# EAGLE schematic PlatineUntenV2 (EAGLE 9.3.0)

## Sheet 1 of 7: Teensy 3.6
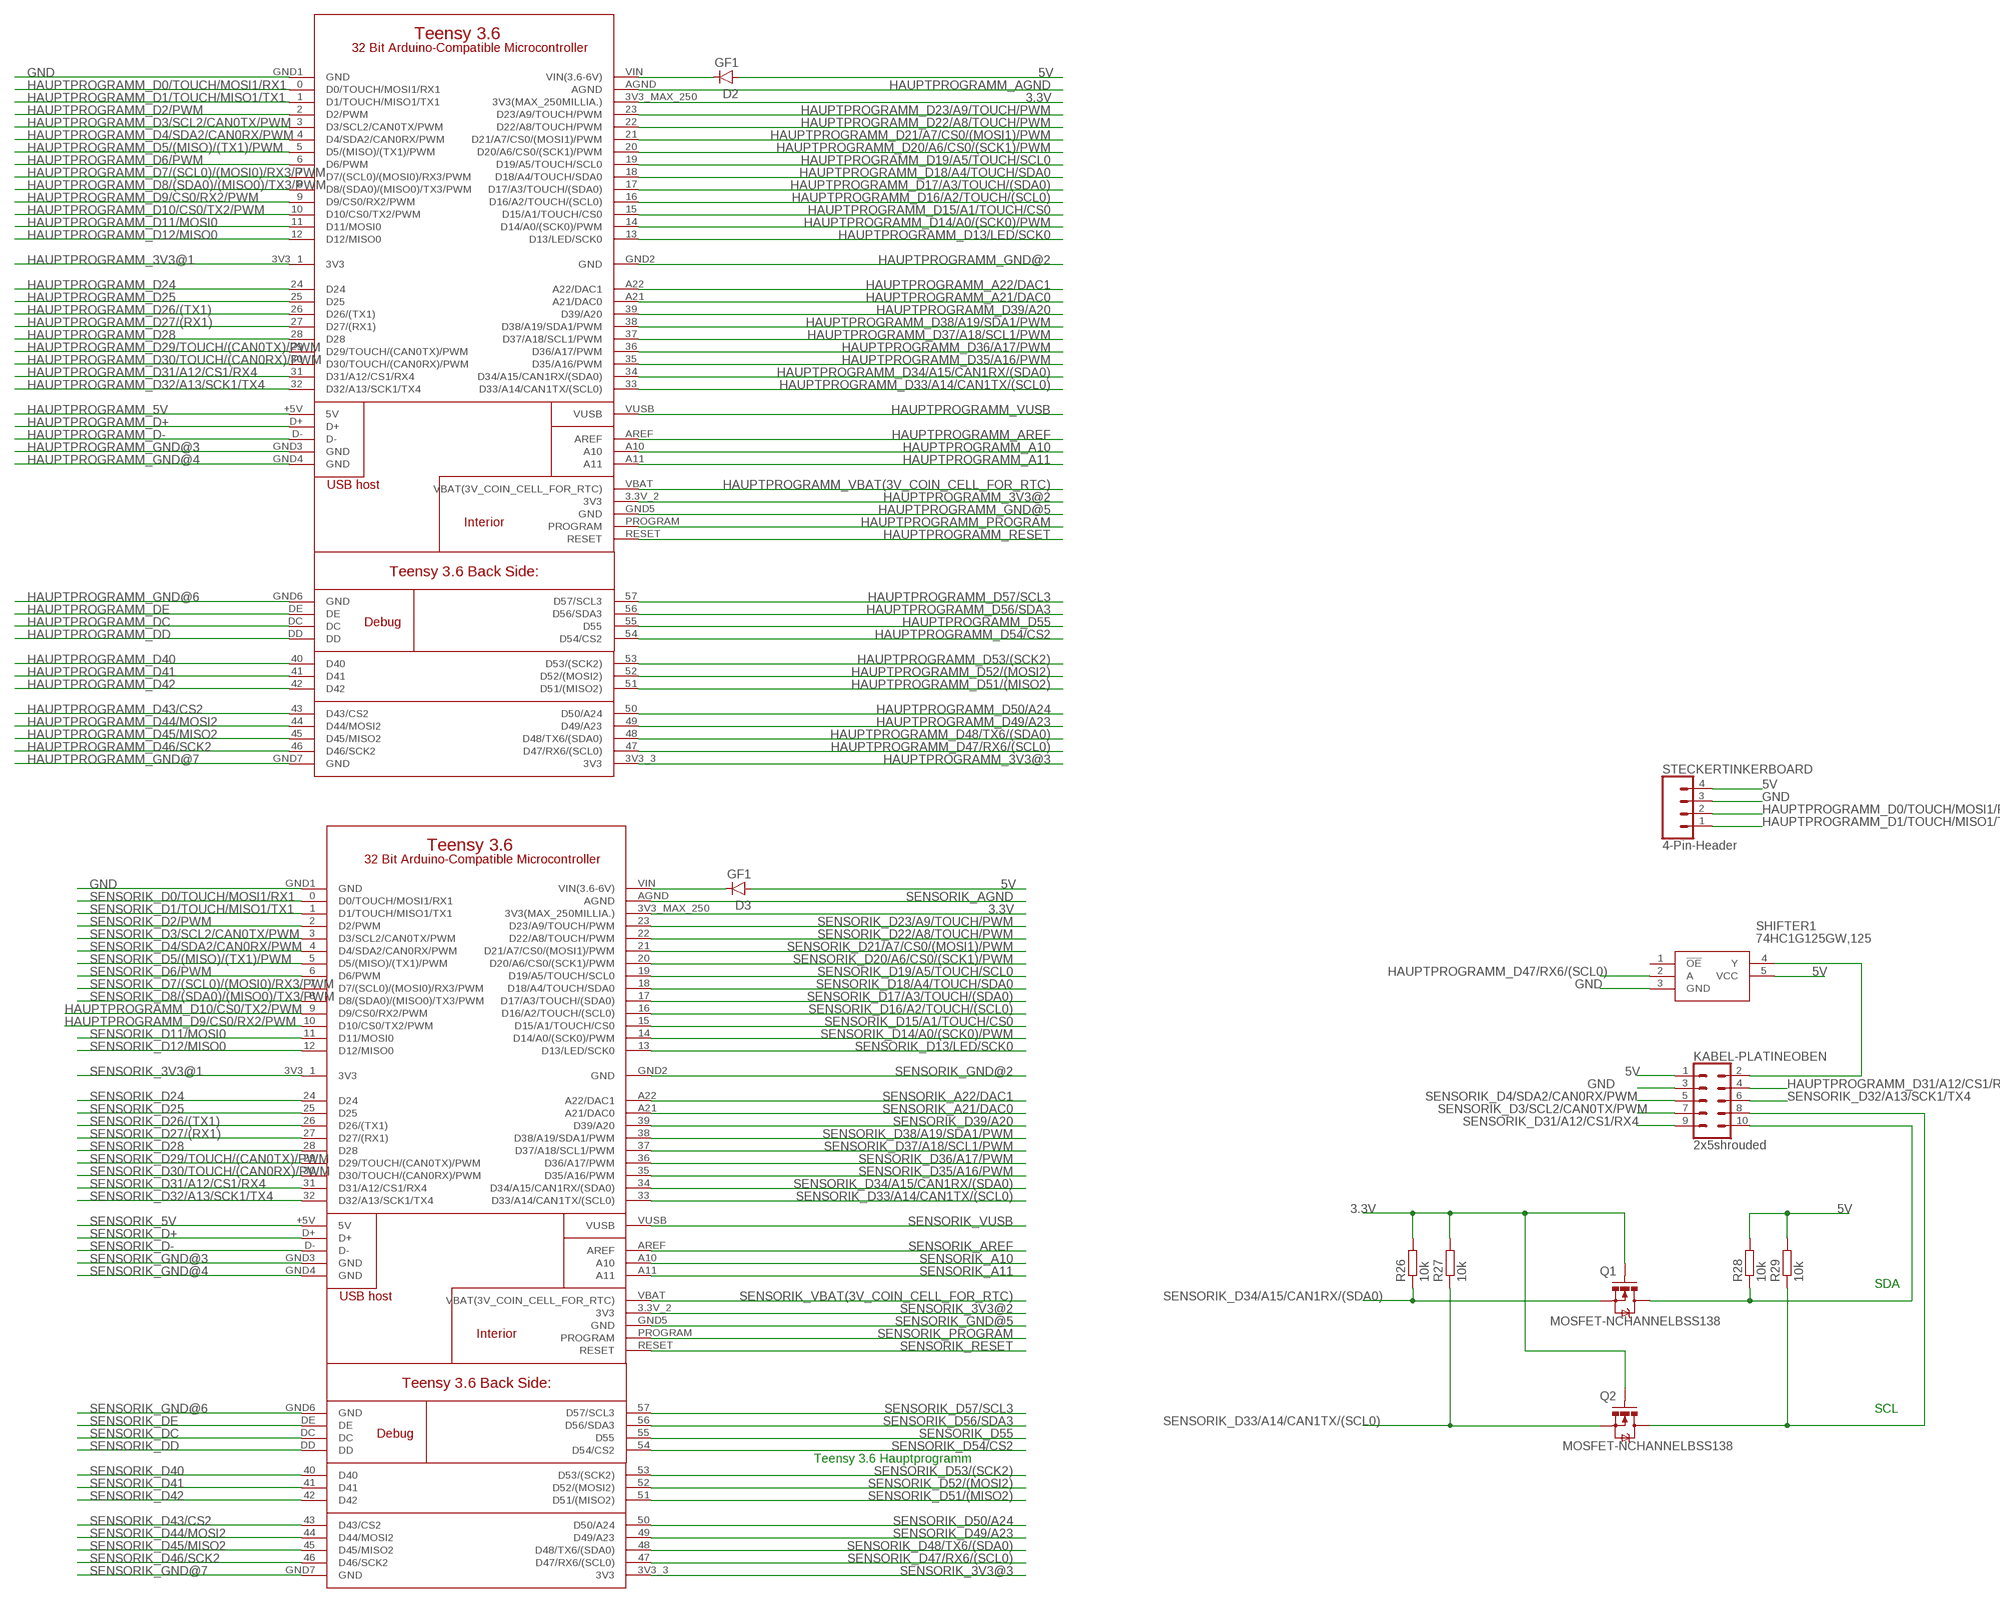
[diagram p0: schematic, sheet 1]

### Parts
D2  GF1  [SMA-DO214AC]
D3  GF1  [SMA-DO214AC]
HAUPTPROGRAMM  TEENSY3.6_FULL  [TEENSY3.6_FULL]
KABEL-PLATINEOBEN  2x5shrouded  CONN_05X2  [2X5-SHROUDED(3D)]
Q1  MOSFET-NCHANNELBSS138  [SOT23]
Q2  MOSFET-NCHANNELBSS138  [SOT23]
R26  10k  R-EU_R0805  [R0805]
R27  10k  R-EU_R0805  [R0805]
R28  10k  R-EU_R0805  [R0805]
R29  10k  R-EU_R0805  [R0805]
SENSORIK  TEENSY3.6_FULL  [TEENSY3.6_FULL]
SHIFTER1  74HC1G125GW,125  [SOT65P212X110-5N]
STECKERTINKERBOARD  4-Pin-Header  CONN_04  [1X04]

### Nets
3.3V [int1A]: HAUPTPROGRAMM.3V3_MAX_250(3V3(MAX_250MILLIA.)) Q1.1(G) Q2.1(G) R26.2 R27.2 SENSORIK.3V3_MAX_250(3V3(MAX_250MILLIA.)) ; also sheet 3,7
5V [int1A]: D2.A D3.A KABEL-PLATINEOBEN.1 R28.2 R29.2 SHIFTER1.5(VCC) STECKERTINKERBOARD.4 ; also sheet 2,6
GND: HAUPTPROGRAMM.GND1(GND) KABEL-PLATINEOBEN.3 SENSORIK.GND1(GND) SHIFTER1.3(GND) STECKERTINKERBOARD.3 ; also sheet 2,3,4,5,6,7
HAUPTPROGRAMM_3V3@1 [int0.4A]: HAUPTPROGRAMM.3V3_1(3V3)
HAUPTPROGRAMM_3V3@2 [int0.4A]: HAUPTPROGRAMM.3.3V_2(3V3)
HAUPTPROGRAMM_3V3@3 [int0.4A]: HAUPTPROGRAMM.3V3_3(3V3)
HAUPTPROGRAMM_5V [int0.4A]: HAUPTPROGRAMM.+5V(5V)
HAUPTPROGRAMM_A10 [int0.4A]: HAUPTPROGRAMM.A10
HAUPTPROGRAMM_A11 [int0.4A]: HAUPTPROGRAMM.A11
HAUPTPROGRAMM_A21/DAC0 [int0.4A]: HAUPTPROGRAMM.A21(A21/DAC0)
HAUPTPROGRAMM_A22/DAC1 [int0.4A]: HAUPTPROGRAMM.A22(A22/DAC1)
HAUPTPROGRAMM_AGND [int1A]: HAUPTPROGRAMM.AGND
HAUPTPROGRAMM_AREF [int0.4A]: HAUPTPROGRAMM.AREF
HAUPTPROGRAMM_D0/TOUCH/MOSI1/RX1 [int0.4A]: HAUPTPROGRAMM.0(D0/TOUCH/MOSI1/RX1) STECKERTINKERBOARD.2
HAUPTPROGRAMM_D1/TOUCH/MISO1/TX1 [int0.4A]: HAUPTPROGRAMM.1(D1/TOUCH/MISO1/TX1) STECKERTINKERBOARD.1
HAUPTPROGRAMM_D2/PWM [int0.4A]: HAUPTPROGRAMM.2(D2/PWM) ; also sheet 7
HAUPTPROGRAMM_D3/SCL2/CAN0TX/PWM [int0.4A]: HAUPTPROGRAMM.3(D3/SCL2/CAN0TX/PWM)
HAUPTPROGRAMM_D4/SDA2/CAN0RX/PWM [int0.4A]: HAUPTPROGRAMM.4(D4/SDA2/CAN0RX/PWM) ; also sheet 7
HAUPTPROGRAMM_D5/(MISO)/(TX1)/PWM [int0.4A]: HAUPTPROGRAMM.5(D5/(MISO)/(TX1)/PWM)
HAUPTPROGRAMM_D6/PWM [int0.4A]: HAUPTPROGRAMM.6(D6/PWM) ; also sheet 7
HAUPTPROGRAMM_D7/(SCL0)/(MOSI0)/RX3/PWM [int0.4A]: HAUPTPROGRAMM.7(D7/(SCL0)/(MOSI0)/RX3/PWM) ; also sheet 7
HAUPTPROGRAMM_D8/(SDA0)/(MISO0)/TX3/PWM [int0.4A]: HAUPTPROGRAMM.8(D8/(SDA0)/(MISO0)/TX3/PWM)
HAUPTPROGRAMM_D9/CS0/RX2/PWM [int0.4A]: HAUPTPROGRAMM.9(D9/CS0/RX2/PWM) SENSORIK.10(D10/CS0/TX2/PWM)
HAUPTPROGRAMM_D10/CS0/TX2/PWM [int0.4A]: HAUPTPROGRAMM.10(D10/CS0/TX2/PWM) SENSORIK.9(D9/CS0/RX2/PWM)
HAUPTPROGRAMM_D11/MOSI0 [int0.4A]: HAUPTPROGRAMM.11(D11/MOSI0) ; also sheet 7
HAUPTPROGRAMM_D12/MISO0 [int0.4A]: HAUPTPROGRAMM.12(D12/MISO0)
HAUPTPROGRAMM_D13/LED/SCK0 [int0.4A]: HAUPTPROGRAMM.13(D13/LED/SCK0) ; also sheet 7
HAUPTPROGRAMM_D14/A0/(SCK0)/PWM [int0.4A]: HAUPTPROGRAMM.14(D14/A0/(SCK0)/PWM) ; also sheet 7
HAUPTPROGRAMM_D15/A1/TOUCH/CS0 [int0.4A]: HAUPTPROGRAMM.15(D15/A1/TOUCH/CS0) ; also sheet 3
HAUPTPROGRAMM_D16/A2/TOUCH/(SCL0) [int0.4A]: HAUPTPROGRAMM.16(D16/A2/TOUCH/(SCL0)) ; also sheet 7
HAUPTPROGRAMM_D17/A3/TOUCH/(SDA0) [int0.4A]: HAUPTPROGRAMM.17(D17/A3/TOUCH/(SDA0)) ; also sheet 7
HAUPTPROGRAMM_D18/A4/TOUCH/SDA0 [int0.4A]: HAUPTPROGRAMM.18(D18/A4/TOUCH/SDA0) ; also sheet 7
HAUPTPROGRAMM_D19/A5/TOUCH/SCL0 [int0.4A]: HAUPTPROGRAMM.19(D19/A5/TOUCH/SCL0) ; also sheet 7
HAUPTPROGRAMM_D20/A6/CS0/(SCK1)/PWM [int0.4A]: HAUPTPROGRAMM.20(D20/A6/CS0/(SCK1)/PWM) ; also sheet 7
HAUPTPROGRAMM_D21/A7/CS0/(MOSI1)/PWM [int0.4A]: HAUPTPROGRAMM.21(D21/A7/CS0/(MOSI1)/PWM) ; also sheet 7
HAUPTPROGRAMM_D22/A8/TOUCH/PWM [int0.4A]: HAUPTPROGRAMM.22(D22/A8/TOUCH/PWM) ; also sheet 7
HAUPTPROGRAMM_D23/A9/TOUCH/PWM [int0.4A]: HAUPTPROGRAMM.23(D23/A9/TOUCH/PWM) ; also sheet 7
HAUPTPROGRAMM_D24 [int0.4A]: HAUPTPROGRAMM.24(D24) ; also sheet 3
HAUPTPROGRAMM_D25 [int0.4A]: HAUPTPROGRAMM.25(D25) ; also sheet 3
HAUPTPROGRAMM_D26/(TX1) [int0.4A]: HAUPTPROGRAMM.26(D26/(TX1)) ; also sheet 7
HAUPTPROGRAMM_D27/(RX1) [int0.4A]: HAUPTPROGRAMM.27(D27/(RX1))
HAUPTPROGRAMM_D28 [int0.4A]: HAUPTPROGRAMM.28(D28) ; also sheet 3
HAUPTPROGRAMM_D29/TOUCH/(CAN0TX)/PWM [int0.4A]: HAUPTPROGRAMM.29(D29/TOUCH/(CAN0TX)/PWM) ; also sheet 4
HAUPTPROGRAMM_D30/TOUCH/(CAN0RX)/PWM [int0.4A]: HAUPTPROGRAMM.30(D30/TOUCH/(CAN0RX)/PWM)
HAUPTPROGRAMM_D31/A12/CS1/RX4 [int0.4A]: HAUPTPROGRAMM.31(D31/A12/CS1/RX4) KABEL-PLATINEOBEN.4
HAUPTPROGRAMM_D32/A13/SCK1/TX4 [int0.4A]: HAUPTPROGRAMM.32(D32/A13/SCK1/TX4) ; also sheet 5
HAUPTPROGRAMM_D33/A14/CAN1TX/(SCL0) [int0.4A]: HAUPTPROGRAMM.33(D33/A14/CAN1TX/(SCL0)) ; also sheet 5
HAUPTPROGRAMM_D34/A15/CAN1RX/(SDA0) [int0.4A]: HAUPTPROGRAMM.34(D34/A15/CAN1RX/(SDA0)) ; also sheet 5
HAUPTPROGRAMM_D35/A16/PWM [int0.4A]: HAUPTPROGRAMM.35(D35/A16/PWM) ; also sheet 5
HAUPTPROGRAMM_D36/A17/PWM [int0.4A]: HAUPTPROGRAMM.36(D36/A17/PWM) ; also sheet 7
HAUPTPROGRAMM_D37/A18/SCL1/PWM [int0.4A]: HAUPTPROGRAMM.37(D37/A18/SCL1/PWM) ; also sheet 7
HAUPTPROGRAMM_D38/A19/SDA1/PWM [int0.4A]: HAUPTPROGRAMM.38(D38/A19/SDA1/PWM) ; also sheet 7
HAUPTPROGRAMM_D39/A20 [int0.4A]: HAUPTPROGRAMM.39(D39/A20) ; also sheet 7
HAUPTPROGRAMM_D40 [int0.4A]: HAUPTPROGRAMM.40(D40) ; also sheet 3
HAUPTPROGRAMM_D41 [int0.4A]: HAUPTPROGRAMM.41(D41) ; also sheet 3
HAUPTPROGRAMM_D42 [int0.4A]: HAUPTPROGRAMM.42(D42) ; also sheet 3
HAUPTPROGRAMM_D43/CS2 [int0.4A]: HAUPTPROGRAMM.43(D43/CS2) ; also sheet 3
HAUPTPROGRAMM_D44/MOSI2 [int0.4A]: HAUPTPROGRAMM.44(D44/MOSI2) ; also sheet 3
HAUPTPROGRAMM_D45/MISO2 [int0.4A]: HAUPTPROGRAMM.45(D45/MISO2) ; also sheet 3
HAUPTPROGRAMM_D46/SCK2 [int0.4A]: HAUPTPROGRAMM.46(D46/SCK2) ; also sheet 3
HAUPTPROGRAMM_D47/RX6/(SCL0) [int0.4A]: HAUPTPROGRAMM.47(D47/RX6/(SCL0)) SHIFTER1.2(A)
HAUPTPROGRAMM_D48/TX6/(SDA0) [int0.4A]: HAUPTPROGRAMM.48(D48/TX6/(SDA0)) ; also sheet 2
HAUPTPROGRAMM_D49/A23 [int0.4A]: HAUPTPROGRAMM.49(D49/A23) ; also sheet 3
HAUPTPROGRAMM_D50/A24 [int0.4A]: HAUPTPROGRAMM.50(D50/A24)
HAUPTPROGRAMM_D51/(MISO2) [int0.4A]: HAUPTPROGRAMM.51(D51/(MISO2)) ; also sheet 3
HAUPTPROGRAMM_D52/(MOSI2) [int0.4A]: HAUPTPROGRAMM.52(D52/(MOSI2))
HAUPTPROGRAMM_D53/(SCK2) [int0.4A]: HAUPTPROGRAMM.53(D53/(SCK2)) ; also sheet 3
HAUPTPROGRAMM_D54/CS2 [int0.4A]: HAUPTPROGRAMM.54(D54/CS2) ; also sheet 3
HAUPTPROGRAMM_D55 [int0.4A]: HAUPTPROGRAMM.55(D55) ; also sheet 3
HAUPTPROGRAMM_D56/SDA3 [int0.4A]: HAUPTPROGRAMM.56(D56/SDA3)
HAUPTPROGRAMM_D57/SCL3 [int0.4A]: HAUPTPROGRAMM.57(D57/SCL3)
HAUPTPROGRAMM_D+ [int0.4A]: HAUPTPROGRAMM.D+
HAUPTPROGRAMM_D- [int0.4A]: HAUPTPROGRAMM.D-
HAUPTPROGRAMM_DC [int0.4A]: HAUPTPROGRAMM.DC
HAUPTPROGRAMM_DD [int0.4A]: HAUPTPROGRAMM.DD
HAUPTPROGRAMM_DE [int0.4A]: HAUPTPROGRAMM.DE
HAUPTPROGRAMM_GND@2 [int0.4A]: HAUPTPROGRAMM.GND2(GND)
HAUPTPROGRAMM_GND@3 [int0.4A]: HAUPTPROGRAMM.GND3(GND)
HAUPTPROGRAMM_GND@4 [int0.4A]: HAUPTPROGRAMM.GND4(GND)
HAUPTPROGRAMM_GND@5 [int0.4A]: HAUPTPROGRAMM.GND5(GND)
HAUPTPROGRAMM_GND@6 [int0.4A]: HAUPTPROGRAMM.GND6(GND)
HAUPTPROGRAMM_GND@7 [int0.4A]: HAUPTPROGRAMM.GND7(GND)
HAUPTPROGRAMM_PROGRAM [int0.4A]: HAUPTPROGRAMM.PROGRAM
HAUPTPROGRAMM_RESET [int0.4A]: HAUPTPROGRAMM.RESET
HAUPTPROGRAMM_VBAT(3V_COIN_CELL_FOR_RTC) [int0.4A]: HAUPTPROGRAMM.VBAT(VBAT(3V_COIN_CELL_FOR_RTC))
HAUPTPROGRAMM_VUSB [int0.4A]: HAUPTPROGRAMM.VUSB
N$1 [int1A]: D2.K(C) HAUPTPROGRAMM.VIN(VIN(3.6-6V))
N$2: D3.K(C) SENSORIK.VIN(VIN(3.6-6V))
N$7: KABEL-PLATINEOBEN.10 Q1.3(D) R28.1
N$10: KABEL-PLATINEOBEN.8 Q2.3(D) R29.1
N$52 [int0.1A]: KABEL-PLATINEOBEN.2 SHIFTER1.4(Y)
SENSORIK_3V3@1: SENSORIK.3V3_1(3V3)
SENSORIK_3V3@2: SENSORIK.3.3V_2(3V3)
SENSORIK_3V3@3: SENSORIK.3V3_3(3V3)
SENSORIK_5V: SENSORIK.+5V(5V)
SENSORIK_A10: SENSORIK.A10
SENSORIK_A11: SENSORIK.A11
SENSORIK_A21/DAC0: SENSORIK.A21(A21/DAC0)
SENSORIK_A22/DAC1: SENSORIK.A22(A22/DAC1)
SENSORIK_AGND: SENSORIK.AGND
SENSORIK_AREF: SENSORIK.AREF
SENSORIK_D0/TOUCH/MOSI1/RX1: SENSORIK.0(D0/TOUCH/MOSI1/RX1)
SENSORIK_D1/TOUCH/MISO1/TX1: SENSORIK.1(D1/TOUCH/MISO1/TX1)
SENSORIK_D2/PWM: SENSORIK.2(D2/PWM)
SENSORIK_D3/SCL2/CAN0TX/PWM [int0.1A]: KABEL-PLATINEOBEN.7 SENSORIK.3(D3/SCL2/CAN0TX/PWM) ; also sheet 3
SENSORIK_D4/SDA2/CAN0RX/PWM [int0.1A]: KABEL-PLATINEOBEN.5 SENSORIK.4(D4/SDA2/CAN0RX/PWM) ; also sheet 3
SENSORIK_D5/(MISO)/(TX1)/PWM: SENSORIK.5(D5/(MISO)/(TX1)/PWM)
SENSORIK_D6/PWM: SENSORIK.6(D6/PWM)
SENSORIK_D7/(SCL0)/(MOSI0)/RX3/PWM: SENSORIK.7(D7/(SCL0)/(MOSI0)/RX3/PWM)
SENSORIK_D8/(SDA0)/(MISO0)/TX3/PWM: SENSORIK.8(D8/(SDA0)/(MISO0)/TX3/PWM)
SENSORIK_D11/MOSI0: SENSORIK.11(D11/MOSI0)
SENSORIK_D12/MISO0: SENSORIK.12(D12/MISO0)
SENSORIK_D13/LED/SCK0: SENSORIK.13(D13/LED/SCK0)
SENSORIK_D14/A0/(SCK0)/PWM: SENSORIK.14(D14/A0/(SCK0)/PWM)
SENSORIK_D15/A1/TOUCH/CS0: SENSORIK.15(D15/A1/TOUCH/CS0)
SENSORIK_D16/A2/TOUCH/(SCL0): SENSORIK.16(D16/A2/TOUCH/(SCL0))
SENSORIK_D17/A3/TOUCH/(SDA0): SENSORIK.17(D17/A3/TOUCH/(SDA0))
SENSORIK_D18/A4/TOUCH/SDA0 [int0.1A]: SENSORIK.18(D18/A4/TOUCH/SDA0) ; also sheet 3
SENSORIK_D19/A5/TOUCH/SCL0 [int0.1A]: SENSORIK.19(D19/A5/TOUCH/SCL0) ; also sheet 3
SENSORIK_D20/A6/CS0/(SCK1)/PWM: SENSORIK.20(D20/A6/CS0/(SCK1)/PWM)
SENSORIK_D21/A7/CS0/(MOSI1)/PWM: SENSORIK.21(D21/A7/CS0/(MOSI1)/PWM)
SENSORIK_D22/A8/TOUCH/PWM: SENSORIK.22(D22/A8/TOUCH/PWM)
SENSORIK_D23/A9/TOUCH/PWM: SENSORIK.23(D23/A9/TOUCH/PWM)
SENSORIK_D24 [int0.1A]: SENSORIK.24(D24) ; also sheet 3
SENSORIK_D25 [int0.1A]: SENSORIK.25(D25) ; also sheet 3
SENSORIK_D26/(TX1): SENSORIK.26(D26/(TX1))
SENSORIK_D27/(RX1): SENSORIK.27(D27/(RX1))
SENSORIK_D28 [int0.1A]: SENSORIK.28(D28) ; also sheet 3
SENSORIK_D29/TOUCH/(CAN0TX)/PWM: SENSORIK.29(D29/TOUCH/(CAN0TX)/PWM)
SENSORIK_D30/TOUCH/(CAN0RX)/PWM: SENSORIK.30(D30/TOUCH/(CAN0RX)/PWM)
SENSORIK_D31/A12/CS1/RX4 [int0.1A]: KABEL-PLATINEOBEN.9 SENSORIK.31(D31/A12/CS1/RX4)
SENSORIK_D32/A13/SCK1/TX4 [int0.1A]: KABEL-PLATINEOBEN.6 SENSORIK.32(D32/A13/SCK1/TX4)
SENSORIK_D33/A14/CAN1TX/(SCL0) [int0.1A]: Q2.2(S) R27.1 SENSORIK.33(D33/A14/CAN1TX/(SCL0))
SENSORIK_D34/A15/CAN1RX/(SDA0) [int0.1A]: Q1.2(S) R26.1 SENSORIK.34(D34/A15/CAN1RX/(SDA0))
SENSORIK_D35/A16/PWM: SENSORIK.35(D35/A16/PWM)
SENSORIK_D36/A17/PWM: SENSORIK.36(D36/A17/PWM)
SENSORIK_D37/A18/SCL1/PWM [int0.1A]: SENSORIK.37(D37/A18/SCL1/PWM) ; also sheet 3
SENSORIK_D38/A19/SDA1/PWM [int0.1A]: SENSORIK.38(D38/A19/SDA1/PWM) ; also sheet 3
SENSORIK_D39/A20: SENSORIK.39(D39/A20)
SENSORIK_D40 [int0.1A]: SENSORIK.40(D40) ; also sheet 3
SENSORIK_D41 [int0.1A]: SENSORIK.41(D41) ; also sheet 3
SENSORIK_D42 [int0.1A]: SENSORIK.42(D42) ; also sheet 3
SENSORIK_D43/CS2 [int0.1A]: SENSORIK.43(D43/CS2) ; also sheet 3
SENSORIK_D44/MOSI2: SENSORIK.44(D44/MOSI2)
SENSORIK_D45/MISO2: SENSORIK.45(D45/MISO2)
SENSORIK_D46/SCK2 [int0.1A]: SENSORIK.46(D46/SCK2) ; also sheet 3
SENSORIK_D47/RX6/(SCL0): SENSORIK.47(D47/RX6/(SCL0))
SENSORIK_D48/TX6/(SDA0): SENSORIK.48(D48/TX6/(SDA0))
SENSORIK_D49/A23: SENSORIK.49(D49/A23)
SENSORIK_D50/A24: SENSORIK.50(D50/A24)
SENSORIK_D51/(MISO2): SENSORIK.51(D51/(MISO2))
SENSORIK_D52/(MOSI2): SENSORIK.52(D52/(MOSI2))
SENSORIK_D53/(SCK2): SENSORIK.53(D53/(SCK2))
SENSORIK_D54/CS2: SENSORIK.54(D54/CS2)
SENSORIK_D55: SENSORIK.55(D55)
SENSORIK_D56/SDA3 [int0.1A]: SENSORIK.56(D56/SDA3) ; also sheet 3
SENSORIK_D57/SCL3 [int0.1A]: SENSORIK.57(D57/SCL3) ; also sheet 3
SENSORIK_D+: SENSORIK.D+
SENSORIK_D-: SENSORIK.D-
SENSORIK_DC: SENSORIK.DC
SENSORIK_DD: SENSORIK.DD
SENSORIK_DE: SENSORIK.DE
SENSORIK_GND@2: SENSORIK.GND2(GND)
SENSORIK_GND@3: SENSORIK.GND3(GND)
SENSORIK_GND@4: SENSORIK.GND4(GND)
SENSORIK_GND@5: SENSORIK.GND5(GND)
SENSORIK_GND@6: SENSORIK.GND6(GND)
SENSORIK_GND@7: SENSORIK.GND7(GND)
SENSORIK_PROGRAM: SENSORIK.PROGRAM
SENSORIK_RESET: SENSORIK.RESET
SENSORIK_VBAT(3V_COIN_CELL_FOR_RTC): SENSORIK.VBAT(VBAT(3V_COIN_CELL_FOR_RTC))
SENSORIK_VUSB: SENSORIK.VUSB
Unconnected: SHIFTER1.1(!OE)

### Notes on the sheet
- SDA
- SCL
- Teensy 3.6 Hauptprogramm

## Sheet 2 of 7: Led
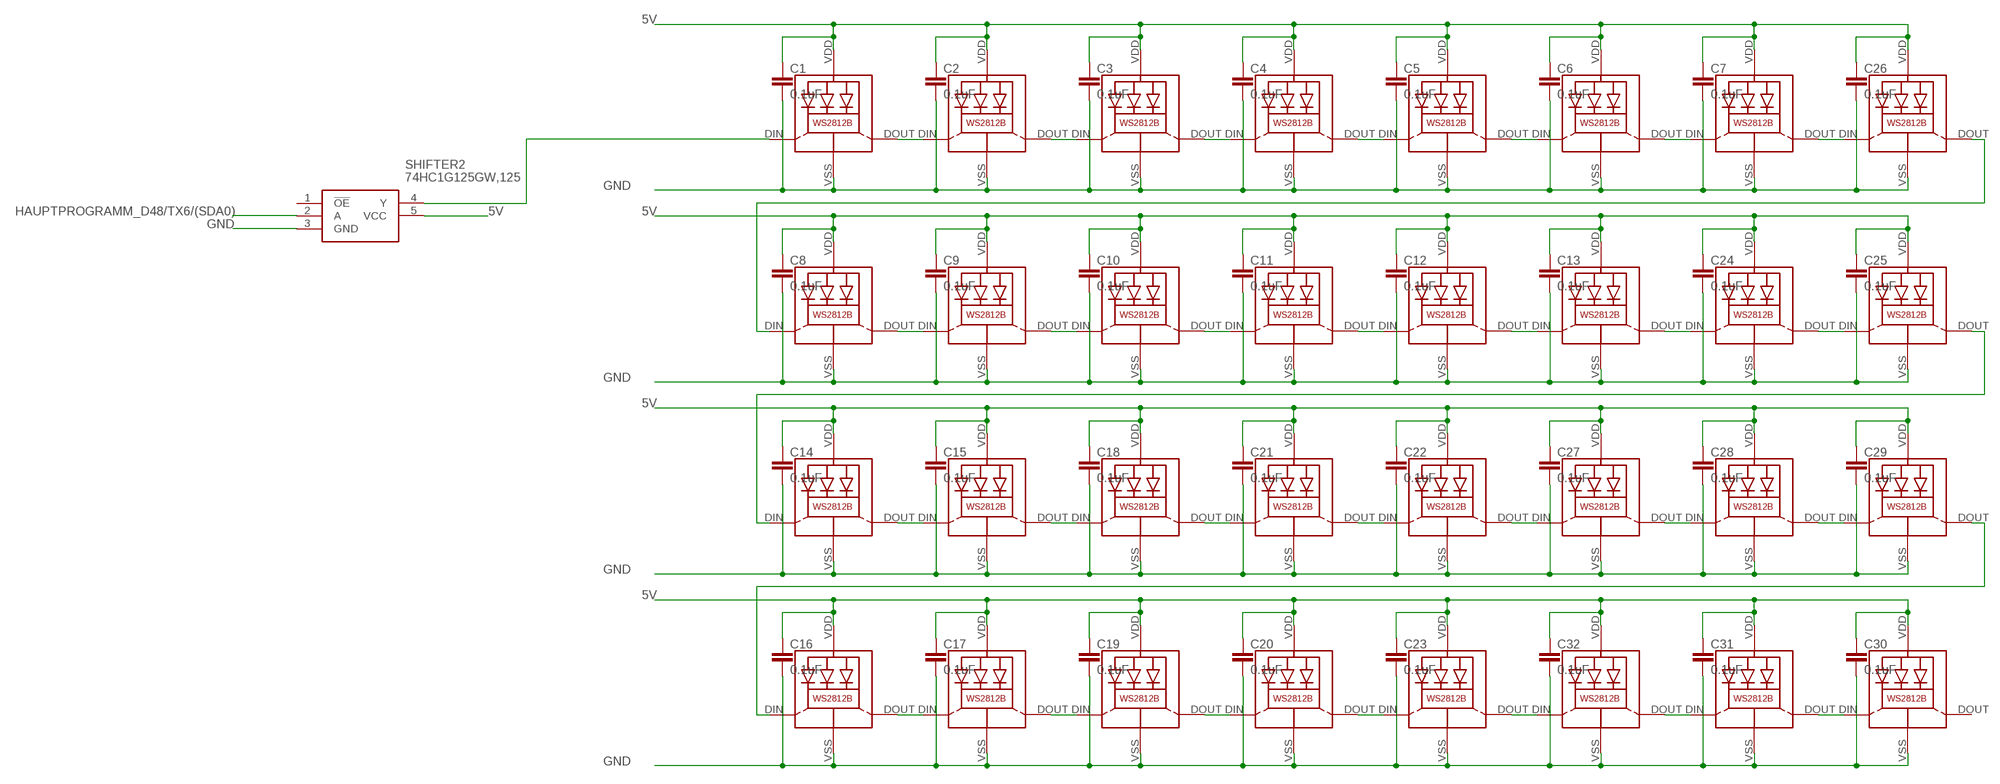
[diagram p1: schematic, sheet 2]

### Parts
C1  0.1uF  C-EUC0805  [C0805]
C2  0.1uF  C-EUC0805  [C0805]
C3  0.1uF  C-EUC0805  [C0805]
C4  0.1uF  C-EUC0805  [C0805]
C5  0.1uF  C-EUC0805  [C0805]
C6  0.1uF  C-EUC0805  [C0805]
C7  0.1uF  C-EUC0805  [C0805]
C8  0.1uF  C-EUC0805  [C0805]
C9  0.1uF  C-EUC0805  [C0805]
C10  0.1uF  C-EUC0805  [C0805]
C11  0.1uF  C-EUC0805  [C0805]
C12  0.1uF  C-EUC0805  [C0805]
C13  0.1uF  C-EUC0805  [C0805]
C14  0.1uF  C-EUC0805  [C0805]
C15  0.1uF  C-EUC0805  [C0805]
C16  0.1uF  C-EUC0805  [C0805]
C17  0.1uF  C-EUC0805  [C0805]
C18  0.1uF  C-EUC0805  [C0805]
C19  0.1uF  C-EUC0805  [C0805]
C20  0.1uF  C-EUC0805  [C0805]
C21  0.1uF  C-EUC0805  [C0805]
C22  0.1uF  C-EUC0805  [C0805]
C23  0.1uF  C-EUC0805  [C0805]
C24  0.1uF  C-EUC0805  [C0805]
C25  0.1uF  C-EUC0805  [C0805]
C26  0.1uF  C-EUC0805  [C0805]
C27  0.1uF  C-EUC0805  [C0805]
C28  0.1uF  C-EUC0805  [C0805]
C29  0.1uF  C-EUC0805  [C0805]
C30  0.1uF  C-EUC0805  [C0805]
C31  0.1uF  C-EUC0805  [C0805]
C32  0.1uF  C-EUC0805  [C0805]
LED33  WS2812B  [WS2812B]
LED34  WS2812B  [WS2812B]
LED35  WS2812B  [WS2812B]
LED36  WS2812B  [WS2812B]
LED37  WS2812B  [WS2812B]
LED38  WS2812B  [WS2812B]
LED39  WS2812B  [WS2812B]
LED40  WS2812B  [WS2812B]
LED41  WS2812B  [WS2812B]
LED42  WS2812B  [WS2812B]
LED43  WS2812B  [WS2812B]
LED44  WS2812B  [WS2812B]
LED45  WS2812B  [WS2812B]
LED46  WS2812B  [WS2812B]
LED47  WS2812B  [WS2812B]
LED48  WS2812B  [WS2812B]
LED49  WS2812B  [WS2812B]
LED50  WS2812B  [WS2812B]
LED51  WS2812B  [WS2812B]
LED52  WS2812B  [WS2812B]
LED53  WS2812B  [WS2812B]
LED54  WS2812B  [WS2812B]
LED55  WS2812B  [WS2812B]
LED56  WS2812B  [WS2812B]
LED57  WS2812B  [WS2812B]
LED58  WS2812B  [WS2812B]
LED59  WS2812B  [WS2812B]
LED60  WS2812B  [WS2812B]
LED61  WS2812B  [WS2812B]
LED62  WS2812B  [WS2812B]
LED63  WS2812B  [WS2812B]
LED64  WS2812B  [WS2812B]
SHIFTER2  74HC1G125GW,125  [SOT65P212X110-5N]

### Nets
5V [int1A]: C1.1 C2.1 C3.1 C4.1 C5.1 C6.1 C7.1 C8.1 C9.1 C10.1 C11.1 C12.1 C13.1 C14.1 C15.1 C16.1 C17.1 C18.1 C19.1 C20.1 C21.1 C22.1 C23.1 C24.1 C25.1 C26.1 C27.1 C28.1 C29.1 C30.1 C31.1 C32.1 LED33.VDD LED34.VDD LED35.VDD LED36.VDD LED37.VDD LED38.VDD LED39.VDD LED40.VDD LED41.VDD LED42.VDD LED43.VDD LED44.VDD LED45.VDD LED46.VDD LED47.VDD LED48.VDD LED49.VDD LED50.VDD LED51.VDD LED52.VDD LED53.VDD LED54.VDD LED55.VDD LED56.VDD LED57.VDD LED58.VDD LED59.VDD LED60.VDD LED61.VDD LED62.VDD LED63.VDD LED64.VDD SHIFTER2.5(VCC) ; also sheet 1,6
GND: C1.2 C2.2 C3.2 C4.2 C5.2 C6.2 C7.2 C8.2 C9.2 C10.2 C11.2 C12.2 C13.2 C14.2 C15.2 C16.2 C17.2 C18.2 C19.2 C20.2 C21.2 C22.2 C23.2 C24.2 C25.2 C26.2 C27.2 C28.2 C29.2 C30.2 C31.2 C32.2 LED33.VSS(GND) LED34.VSS(GND) LED35.VSS(GND) LED36.VSS(GND) LED37.VSS(GND) LED38.VSS(GND) LED39.VSS(GND) LED40.VSS(GND) LED41.VSS(GND) LED42.VSS(GND) LED43.VSS(GND) LED44.VSS(GND) LED45.VSS(GND) LED46.VSS(GND) LED47.VSS(GND) LED48.VSS(GND) LED49.VSS(GND) LED50.VSS(GND) LED51.VSS(GND) LED52.VSS(GND) LED53.VSS(GND) LED54.VSS(GND) LED55.VSS(GND) LED56.VSS(GND) LED57.VSS(GND) LED58.VSS(GND) LED59.VSS(GND) LED60.VSS(GND) LED61.VSS(GND) LED62.VSS(GND) LED63.VSS(GND) LED64.VSS(GND) SHIFTER2.3(GND) ; also sheet 1,3,4,5,6,7
HAUPTPROGRAMM_D48/TX6/(SDA0) [int0.4A]: SHIFTER2.2(A) ; also sheet 1
N$53 [int0.1A]: LED33.DIN(DI) SHIFTER2.4(Y)
N$54 [int0.1A]: LED33.DOUT(DO) LED34.DIN(DI)
N$55 [int0.1A]: LED34.DOUT(DO) LED35.DIN(DI)
N$56 [int0.1A]: LED35.DOUT(DO) LED36.DIN(DI)
N$57 [int0.1A]: LED36.DOUT(DO) LED37.DIN(DI)
N$58 [int0.1A]: LED37.DOUT(DO) LED38.DIN(DI)
N$59 [int0.1A]: LED38.DOUT(DO) LED39.DIN(DI)
N$60 [int0.1A]: LED39.DOUT(DO) LED40.DIN(DI)
N$63 [int0.1A]: LED40.DOUT(DO) LED41.DIN(DI)
N$64 [int0.1A]: LED41.DOUT(DO) LED42.DIN(DI)
N$65 [int0.1A]: LED42.DOUT(DO) LED43.DIN(DI)
N$66 [int0.1A]: LED43.DOUT(DO) LED44.DIN(DI)
N$69 [int0.1A]: LED44.DOUT(DO) LED45.DIN(DI)
N$70 [int0.1A]: LED45.DOUT(DO) LED46.DIN(DI)
N$71 [int0.1A]: LED46.DOUT(DO) LED47.DIN(DI)
N$72 [int0.1A]: LED47.DOUT(DO) LED48.DIN(DI)
N$78 [int0.1A]: LED48.DOUT(DO) LED49.DIN(DI)
N$81 [int0.1A]: LED49.DOUT(DO) LED50.DIN(DI)
N$91 [int0.1A]: LED50.DOUT(DO) LED51.DIN(DI)
N$99 [int0.1A]: LED51.DOUT(DO) LED52.DIN(DI)
N$108 [int0.1A]: LED52.DOUT(DO) LED53.DIN(DI)
N$114 [int0.1A]: LED53.DOUT(DO) LED54.DIN(DI)
N$115 [int0.1A]: LED54.DOUT(DO) LED55.DIN(DI)
N$116 [int0.1A]: LED55.DOUT(DO) LED56.DIN(DI)
N$119 [int0.1A]: LED56.DOUT(DO) LED57.DIN(DI)
N$120 [int0.1A]: LED57.DOUT(DO) LED58.DIN(DI)
N$121 [int0.1A]: LED58.DOUT(DO) LED59.DIN(DI)
N$122 [int0.1A]: LED59.DOUT(DO) LED60.DIN(DI)
N$123 [int0.1A]: LED60.DOUT(DO) LED61.DIN(DI)
N$124 [int0.1A]: LED61.DOUT(DO) LED62.DIN(DI)
N$125 [int0.1A]: LED62.DOUT(DO) LED63.DIN(DI)
N$126 [int0.1A]: LED63.DOUT(DO) LED64.DIN(DI)
Unconnected: LED64.DOUT(DO) SHIFTER2.1(!OE)

## Sheet 3 of 7: Bodensensoren
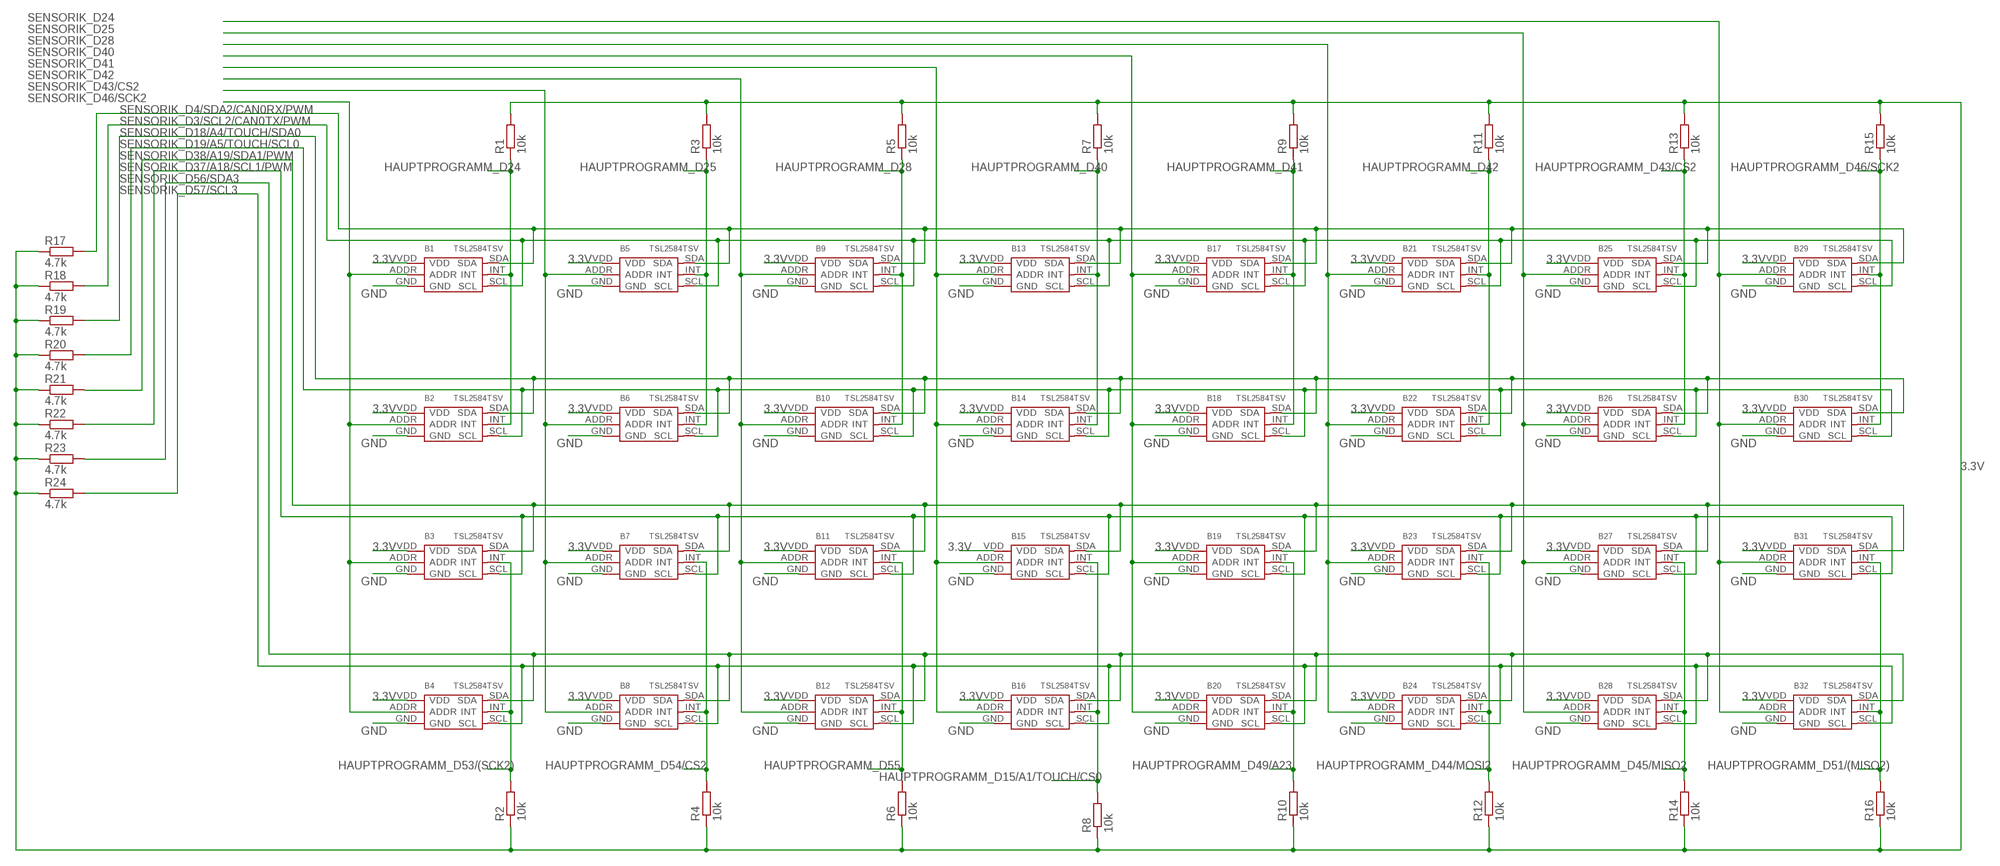
[diagram p2: schematic, sheet 3]

### Parts
B1  TSL2584TSV  [TSL2584TSV]
B2  TSL2584TSV  [TSL2584TSV]
B3  TSL2584TSV  [TSL2584TSV]
B4  TSL2584TSV  [TSL2584TSV]
B5  TSL2584TSV  [TSL2584TSV]
B6  TSL2584TSV  [TSL2584TSV]
B7  TSL2584TSV  [TSL2584TSV]
B8  TSL2584TSV  [TSL2584TSV]
B9  TSL2584TSV  [TSL2584TSV]
B10  TSL2584TSV  [TSL2584TSV]
B11  TSL2584TSV  [TSL2584TSV]
B12  TSL2584TSV  [TSL2584TSV]
B13  TSL2584TSV  [TSL2584TSV]
B14  TSL2584TSV  [TSL2584TSV]
B15  TSL2584TSV  [TSL2584TSV]
B16  TSL2584TSV  [TSL2584TSV]
B17  TSL2584TSV  [TSL2584TSV]
B18  TSL2584TSV  [TSL2584TSV]
B19  TSL2584TSV  [TSL2584TSV]
B20  TSL2584TSV  [TSL2584TSV]
B21  TSL2584TSV  [TSL2584TSV]
B22  TSL2584TSV  [TSL2584TSV]
B23  TSL2584TSV  [TSL2584TSV]
B24  TSL2584TSV  [TSL2584TSV]
B25  TSL2584TSV  [TSL2584TSV]
B26  TSL2584TSV  [TSL2584TSV]
B27  TSL2584TSV  [TSL2584TSV]
B28  TSL2584TSV  [TSL2584TSV]
B29  TSL2584TSV  [TSL2584TSV]
B30  TSL2584TSV  [TSL2584TSV]
B31  TSL2584TSV  [TSL2584TSV]
B32  TSL2584TSV  [TSL2584TSV]
R1  10k  R-EU_R0805  [R0805]
R2  10k  R-EU_R0805  [R0805]
R3  10k  R-EU_R0805  [R0805]
R4  10k  R-EU_R0805  [R0805]
R5  10k  R-EU_R0805  [R0805]
R6  10k  R-EU_R0805  [R0805]
R7  10k  R-EU_R0805  [R0805]
R8  10k  R-EU_R0805  [R0805]
R9  10k  R-EU_R0805  [R0805]
R10  10k  R-EU_R0805  [R0805]
R11  10k  R-EU_R0805  [R0805]
R12  10k  R-EU_R0805  [R0805]
R13  10k  R-EU_R0805  [R0805]
R14  10k  R-EU_R0805  [R0805]
R15  10k  R-EU_R0805  [R0805]
R16  10k  R-EU_R0805  [R0805]
R17  4.7k  R-EU_R0805  [R0805]
R18  4.7k  R-EU_R0805  [R0805]
R19  4.7k  R-EU_R0805  [R0805]
R20  4.7k  R-EU_R0805  [R0805]
R21  4.7k  R-EU_R0805  [R0805]
R22  4.7k  R-EU_R0805  [R0805]
R23  4.7k  R-EU_R0805  [R0805]
R24  4.7k  R-EU_R0805  [R0805]

### Nets
3.3V [int1A]: B1.VDD B2.VDD B3.VDD B4.VDD B5.VDD B6.VDD B7.VDD B8.VDD B9.VDD B10.VDD B11.VDD B12.VDD B13.VDD B14.VDD B15.VDD B16.VDD B17.VDD B18.VDD B19.VDD B20.VDD B21.VDD B22.VDD B23.VDD B24.VDD B25.VDD B26.VDD B27.VDD B28.VDD B29.VDD B30.VDD B31.VDD B32.VDD R1.2 R2.1 R3.2 R4.1 R5.2 R6.1 R7.2 R8.1 R9.2 R10.1 R11.2 R12.1 R13.2 R14.1 R15.2 R16.1 R17.1 R18.1 R19.1 R20.1 R21.1 R22.1 R23.1 R24.1 ; also sheet 1,7
GND: B1.GND B2.GND B3.GND B4.GND B5.GND B6.GND B7.GND B8.GND B9.GND B10.GND B11.GND B12.GND B13.GND B14.GND B15.GND B16.GND B17.GND B18.GND B19.GND B20.GND B21.GND B22.GND B23.GND B24.GND B25.GND B26.GND B27.GND B28.GND B29.GND B30.GND B31.GND B32.GND ; also sheet 1,2,4,5,6,7
HAUPTPROGRAMM_D15/A1/TOUCH/CS0 [int0.4A]: B15.INT B16.INT R8.2 ; also sheet 1
HAUPTPROGRAMM_D24 [int0.4A]: B1.INT B2.INT R1.1 ; also sheet 1
HAUPTPROGRAMM_D25 [int0.4A]: B5.INT B6.INT R3.1 ; also sheet 1
HAUPTPROGRAMM_D28 [int0.4A]: B9.INT B10.INT R5.1 ; also sheet 1
HAUPTPROGRAMM_D40 [int0.4A]: B13.INT B14.INT R7.1 ; also sheet 1
HAUPTPROGRAMM_D41 [int0.4A]: B17.INT B18.INT R9.1 ; also sheet 1
HAUPTPROGRAMM_D42 [int0.4A]: B21.INT B22.INT R11.1 ; also sheet 1
HAUPTPROGRAMM_D43/CS2 [int0.4A]: B25.INT B26.INT R13.1 ; also sheet 1
HAUPTPROGRAMM_D44/MOSI2 [int0.4A]: B23.INT B24.INT R12.2 ; also sheet 1
HAUPTPROGRAMM_D45/MISO2 [int0.4A]: B27.INT B28.INT R14.2 ; also sheet 1
HAUPTPROGRAMM_D46/SCK2 [int0.4A]: B29.INT B30.INT R15.1 ; also sheet 1
HAUPTPROGRAMM_D49/A23 [int0.4A]: B19.INT B20.INT R10.2 ; also sheet 1
HAUPTPROGRAMM_D51/(MISO2) [int0.4A]: B31.INT B32.INT R16.2 ; also sheet 1
HAUPTPROGRAMM_D53/(SCK2) [int0.4A]: B3.INT B4.INT R2.2 ; also sheet 1
HAUPTPROGRAMM_D54/CS2 [int0.4A]: B7.INT B8.INT R4.2 ; also sheet 1
HAUPTPROGRAMM_D55 [int0.4A]: B11.INT B12.INT R6.2 ; also sheet 1
SENSORIK_D3/SCL2/CAN0TX/PWM [int0.1A]: B1.SCL B5.SCL B9.SCL B13.SCL B17.SCL B21.SCL B25.SCL B29.SCL R18.2 ; also sheet 1
SENSORIK_D4/SDA2/CAN0RX/PWM [int0.1A]: B1.SDA B5.SDA B9.SDA B13.SDA B17.SDA B21.SDA B25.SDA B29.SDA R17.2 ; also sheet 1
SENSORIK_D18/A4/TOUCH/SDA0 [int0.1A]: B2.SDA B6.SDA B10.SDA B14.SDA B18.SDA B22.SDA B26.SDA B30.SDA R19.2 ; also sheet 1
SENSORIK_D19/A5/TOUCH/SCL0 [int0.1A]: B2.SCL B6.SCL B10.SCL B14.SCL B18.SCL B22.SCL B26.SCL B30.SCL R20.2 ; also sheet 1
SENSORIK_D24 [int0.1A]: B29.ADDR B30.ADDR B31.ADDR B32.ADDR ; also sheet 1
SENSORIK_D25 [int0.1A]: B25.ADDR B26.ADDR B27.ADDR B28.ADDR ; also sheet 1
SENSORIK_D28 [int0.1A]: B21.ADDR B22.ADDR B23.ADDR B24.ADDR ; also sheet 1
SENSORIK_D37/A18/SCL1/PWM [int0.1A]: B3.SCL B7.SCL B11.SCL B15.SCL B19.SCL B23.SCL B27.SCL B31.SCL R22.2 ; also sheet 1
SENSORIK_D38/A19/SDA1/PWM [int0.1A]: B3.SDA B7.SDA B11.SDA B15.SDA B19.SDA B23.SDA B27.SDA B31.SDA R21.2 ; also sheet 1
SENSORIK_D40 [int0.1A]: B17.ADDR B18.ADDR B19.ADDR B20.ADDR ; also sheet 1
SENSORIK_D41 [int0.1A]: B13.ADDR B14.ADDR B15.ADDR B16.ADDR ; also sheet 1
SENSORIK_D42 [int0.1A]: B9.ADDR B10.ADDR B11.ADDR B12.ADDR ; also sheet 1
SENSORIK_D43/CS2 [int0.1A]: B5.ADDR B6.ADDR B7.ADDR B8.ADDR ; also sheet 1
SENSORIK_D46/SCK2 [int0.1A]: B1.ADDR B2.ADDR B3.ADDR B4.ADDR ; also sheet 1
SENSORIK_D56/SDA3 [int0.1A]: B4.SDA B8.SDA B12.SDA B16.SDA B20.SDA B24.SDA B28.SDA B32.SDA R23.2 ; also sheet 1
SENSORIK_D57/SCL3 [int0.1A]: B4.SCL B8.SCL B12.SCL B16.SCL B20.SCL B24.SCL B28.SCL B32.SCL R24.2 ; also sheet 1

## Sheet 4 of 7: Schuss
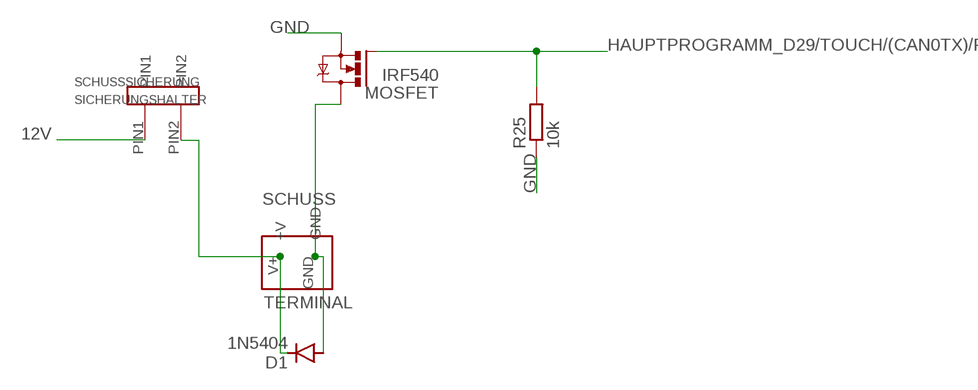
[diagram p3: schematic, sheet 4]

### Parts
D1  1N5404  1N5400  [DO201-15]
MOSFET  IRF540  [TO220BV]
R25  10k  R-EU_R0805  [R0805]
SCHUSS  TERMINAL  [TERMINAL]
SCHUSSSICHERUNG  SICHERUNGSHALTER  [SICHERUNGSHALTER]

### Nets
12V: SCHUSSSICHERUNG.PIN1 ; also sheet 6
GND: MOSFET.S R25.1 ; also sheet 1,2,3,5,6,7
HAUPTPROGRAMM_D29/TOUCH/(CAN0TX)/PWM [int0.4A]: MOSFET.G R25.2 ; also sheet 1
N$67 [ext10A]: D1.A MOSFET.D SCHUSS.GND
N$68 [ext10A]: D1.C SCHUSS.V+(+V) SCHUSSSICHERUNG.PIN2

## Sheet 5 of 7: Schalter
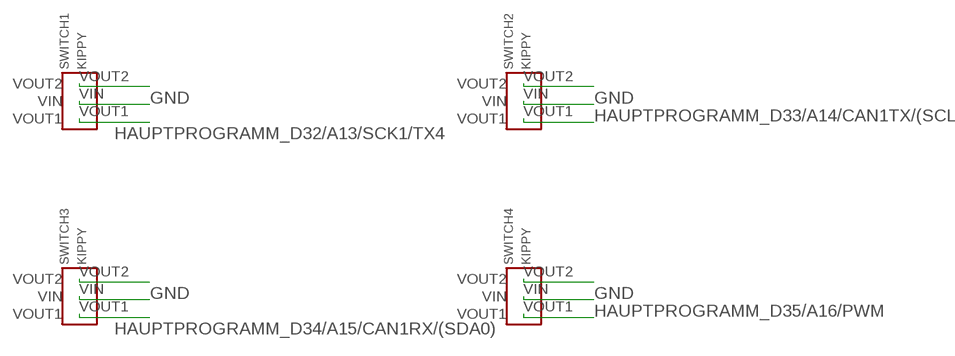
[diagram p4: schematic, sheet 5]

### Parts
SWITCH1  KIPPY  [KIPPY]
SWITCH2  KIPPY  [KIPPY]
SWITCH3  KIPPY  [KIPPY]
SWITCH4  KIPPY  [KIPPY]

### Nets
GND: SWITCH1.VIN SWITCH2.VIN SWITCH3.VIN SWITCH4.VIN ; also sheet 1,2,3,4,6,7
HAUPTPROGRAMM_D32/A13/SCK1/TX4 [int0.4A]: SWITCH1.VOUT1 ; also sheet 1
HAUPTPROGRAMM_D33/A14/CAN1TX/(SCL0) [int0.4A]: SWITCH2.VOUT1 ; also sheet 1
HAUPTPROGRAMM_D34/A15/CAN1RX/(SDA0) [int0.4A]: SWITCH3.VOUT1 ; also sheet 1
HAUPTPROGRAMM_D35/A16/PWM [int0.4A]: SWITCH4.VOUT1 ; also sheet 1
N$5: SWITCH1.VOUT2
N$8: SWITCH2.VOUT2
N$11: SWITCH3.VOUT2
N$77: SWITCH4.VOUT2

## Sheet 6 of 7: Spannungsversorgung
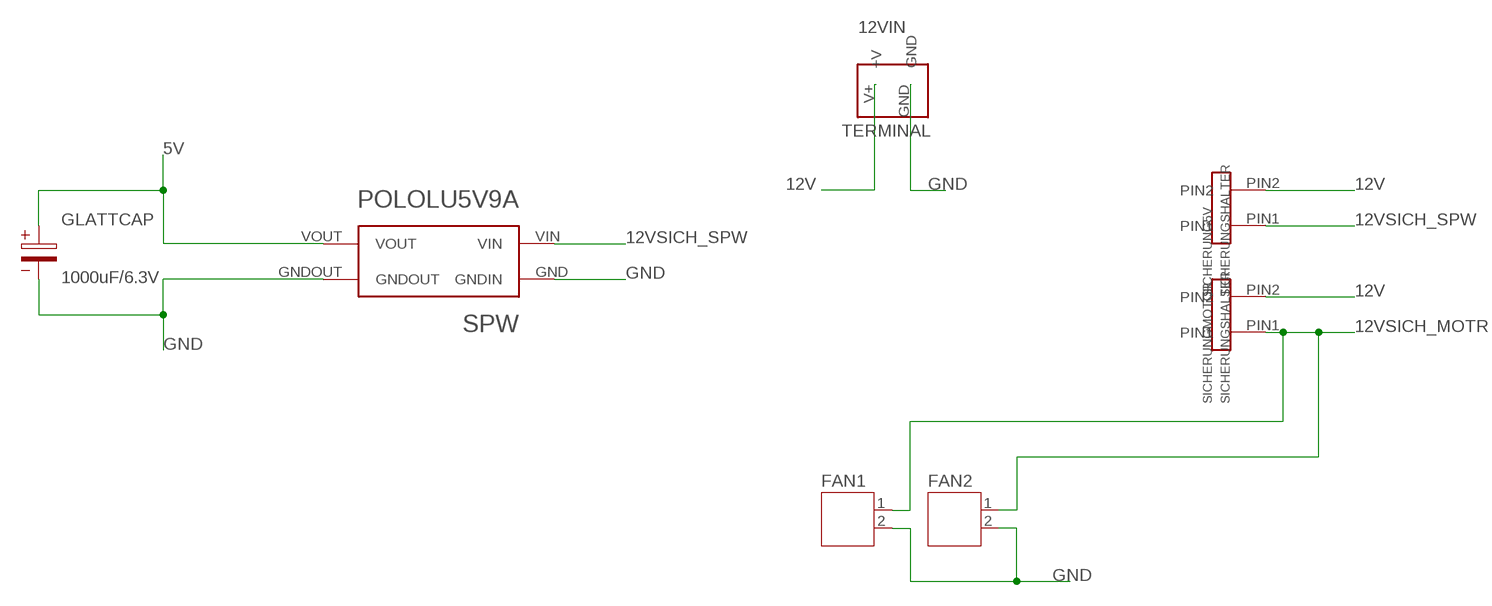
[diagram p5: schematic, sheet 6]

### Parts
12VIN  TERMINAL  [TERMINAL]
FAN1  JST-PH2  [JST-PH2]
FAN2  JST-PH2  [JST-PH2]
GLATTCAP  1000uF/6.3V  GLATTCAP  [GLATTCAP]
SICHERUNG5V  SICHERUNGSHALTER  [SICHERUNGSHALTER]
SICHERUNGMOTOR  SICHERUNGSHALTER  [SICHERUNGSHALTER]
SPW  POLOLU5V9A  [POLOLU5V9A]

### Nets
5V [int1A]: GLATTCAP.1 SPW.VOUT ; also sheet 1,2
12V: 12VIN.V+(+V) SICHERUNG5V.PIN2 SICHERUNGMOTOR.PIN2 ; also sheet 4
12VSICH_MOTR [int1A]: FAN1.1 FAN2.1 SICHERUNGMOTOR.PIN1 ; also sheet 7
12VSICH_SPW [ext9A]: SICHERUNG5V.PIN1 SPW.VIN
GND: 12VIN.GND FAN1.2 FAN2.2 GLATTCAP.2 SPW.GND(GNDIN) SPW.GNDOUT ; also sheet 1,2,3,4,5,7

## Sheet 7 of 7: Motoren
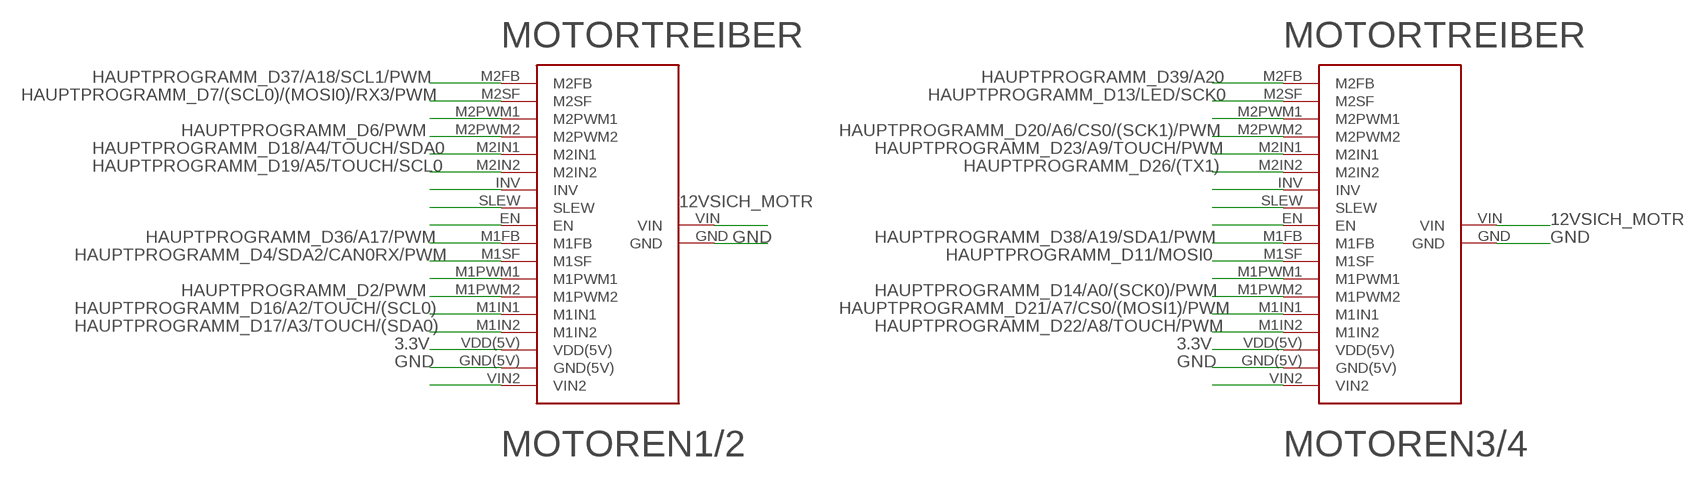
[diagram p6: schematic, sheet 7]

### Parts
MOTOREN1/2  MOTORTREIBER  [MOTORTREIBER]
MOTOREN3/4  MOTORTREIBER  [MOTORTREIBER]

### Nets
3.3V [int1A]: MOTOREN1/2.VDD(5V) MOTOREN3/4.VDD(5V) ; also sheet 1,3
12VSICH_MOTR [int1A]: MOTOREN1/2.VIN MOTOREN3/4.VIN ; also sheet 6
GND: MOTOREN1/2.GND MOTOREN1/2.GND(5V) MOTOREN3/4.GND MOTOREN3/4.GND(5V) ; also sheet 1,2,3,4,5,6
HAUPTPROGRAMM_D2/PWM [int0.4A]: MOTOREN1/2.M1PWM2 ; also sheet 1
HAUPTPROGRAMM_D4/SDA2/CAN0RX/PWM [int0.4A]: MOTOREN1/2.M1SF ; also sheet 1
HAUPTPROGRAMM_D6/PWM [int0.4A]: MOTOREN1/2.M2PWM2 ; also sheet 1
HAUPTPROGRAMM_D7/(SCL0)/(MOSI0)/RX3/PWM [int0.4A]: MOTOREN1/2.M2SF ; also sheet 1
HAUPTPROGRAMM_D11/MOSI0 [int0.4A]: MOTOREN3/4.M1SF ; also sheet 1
HAUPTPROGRAMM_D13/LED/SCK0 [int0.4A]: MOTOREN3/4.M2SF ; also sheet 1
HAUPTPROGRAMM_D14/A0/(SCK0)/PWM [int0.4A]: MOTOREN3/4.M1PWM2 ; also sheet 1
HAUPTPROGRAMM_D16/A2/TOUCH/(SCL0) [int0.4A]: MOTOREN1/2.M1IN1 ; also sheet 1
HAUPTPROGRAMM_D17/A3/TOUCH/(SDA0) [int0.4A]: MOTOREN1/2.M1IN2 ; also sheet 1
HAUPTPROGRAMM_D18/A4/TOUCH/SDA0 [int0.4A]: MOTOREN1/2.M2IN1 ; also sheet 1
HAUPTPROGRAMM_D19/A5/TOUCH/SCL0 [int0.4A]: MOTOREN1/2.M2IN2 ; also sheet 1
HAUPTPROGRAMM_D20/A6/CS0/(SCK1)/PWM [int0.4A]: MOTOREN3/4.M2PWM2 ; also sheet 1
HAUPTPROGRAMM_D21/A7/CS0/(MOSI1)/PWM [int0.4A]: MOTOREN3/4.M1IN1 ; also sheet 1
HAUPTPROGRAMM_D22/A8/TOUCH/PWM [int0.4A]: MOTOREN3/4.M1IN2 ; also sheet 1
HAUPTPROGRAMM_D23/A9/TOUCH/PWM [int0.4A]: MOTOREN3/4.M2IN1 ; also sheet 1
HAUPTPROGRAMM_D26/(TX1) [int0.4A]: MOTOREN3/4.M2IN2 ; also sheet 1
HAUPTPROGRAMM_D36/A17/PWM [int0.4A]: MOTOREN1/2.M1FB ; also sheet 1
HAUPTPROGRAMM_D37/A18/SCL1/PWM [int0.4A]: MOTOREN1/2.M2FB ; also sheet 1
HAUPTPROGRAMM_D38/A19/SDA1/PWM [int0.4A]: MOTOREN3/4.M1FB ; also sheet 1
HAUPTPROGRAMM_D39/A20 [int0.4A]: MOTOREN3/4.M2FB ; also sheet 1
N$80: MOTOREN3/4.M2PWM1
N$84: MOTOREN3/4.INV
N$85: MOTOREN3/4.EN
N$86: MOTOREN3/4.SLEW
N$89: MOTOREN3/4.M1PWM1
N$95: MOTOREN3/4.VIN2
N$98: MOTOREN1/2.M2PWM1
N$102: MOTOREN1/2.INV
N$103: MOTOREN1/2.SLEW
N$104: MOTOREN1/2.EN
N$107: MOTOREN1/2.M1PWM1
N$113: MOTOREN1/2.VIN2

## Library data of the parts
12VIN SCHUSS = BörningComponents:TERMINAL
B1-B32 = BörningComponents:TSL2584TSV
C1-C32 = resistor:C-EU: CAPACITOR, European symbol
D1 = diode:1N5400: DIODE standard rectifier, 3 A, 50 V (Motorola)
D2 D3 = diode:GF1: DIODE
FAN1 FAN2 = BörningComponents:JST-PH2
GLATTCAP = BörningComponents:GLATTCAP: WCAP-PTHT Aluminum Polymer Capacitors Characteristics Aluminum Polymer Capacitor Recommended soldering: Wave Operating temperature: -55°C to +125°C +125°C product series Low ESR at high frequency range Long life: 2000h @ +125°C Package name and Variant abbreviation: Package: D X A X B = Diameter of the outline X Pitch of the hole X Diameter of the hole. <http://katalog.we-online.de/media/images/eisos/WCAP-PTHT_pf2.jpg> Details see: http://katalog.we-online.de/en/pbs/WCAP-PTHT/ Created: 2015-02-06 2015 (C) Wurth Elektronik
HAUPTPROGRAMM = BörningComponents:TEENSY3.6_FULL; SPICEPREFIX: X
KABEL-PLATINEOBEN = BörningComponents:CONN_05X2: Multi connection point. Often used as Generic Header-pin footprint for 0.1 inch spaced/style header connections For AVR SPI programming port, see special device with nice symbol: "AVR_SPI_PROG_5x2.dev" You can populate with any combo of single row headers, but if you'd like an exact match, check these: 2x5 AVR ICSP Male Header <https://www.sparkfun.com/products/778> (PRT-00778) 2x5 Pin Shrouded Header <https://www.sparkfun.com/products/8506> (PRT-08506) On any of the 0.1 inch spaced packages, you can populate with these: Break Away Headers - Straight <https://www.sparkfun.com/products/116> (PRT-00116) Break Away Male Headers - Right Angle <https://www.sparkfun.com/products/553> (PRT-00553) Female Headers <https://www.sparkfun.com/products/115> (PRT-00115) Break Away Headers - Machine Pin <https://www.sparkfun.com/products/117> (PRT-00117) Break Away Female Headers - Swiss Machine Pin <https://www.sparkfun.com/products/743> (PRT-00743) Special note: the shrouded connector mates well with our 5x2 ribbon cables: 2x5 Pin IDC Ribbon Cable <https://www.sparkfun.com/products/8535> (PRT-08535)
LED33-LED64 = BörningComponents:WS2812B: Features and Benefits  * Intelligent reverse connect protection, the power supply reverse connection does not damage the IC. * The control circuit and the LED share the only power source. Control circuit and RGB chip are integrated in a package of 5050 components, form a complete control of pixel point.  * Built-in signal reshaping circuit, after wave reshaping to the next driver, ensure wave-form distortion not accumulate.  * Built-in electric reset circuit and power lost reset circuit.  * Each pixel of the three primary color can achieve 256 brightness display, completed 16777216 color full color display, and scan frequency not less than 400Hz/s.  * Cascading port transmission signal by single line.  * Any two point the distance more than 5m transmission signal without any increase circuit.  * When the refresh rate is 30fps, cascade number are not less than1024 points.  * Send data at speeds of 800Kbps.  *The color of the light were highly consistent, cost-effective. Applications  Full-color module, Full color soft lights a lamp strip. LED decorative lighting, Indoor/outdoor LED video irregular screen. General description WS2812B is a intelligent control LED light source that the control circuit and RGB chip are integrated in a package of 5050 components. It internal include intelligent digital port data latch and signal reshaping amplification drive circuit. Also include a precision internal oscillator and a 12V voltage programmable constant curre-nt control part, effectively ensuring the pixel point light color height consistent. The data transfer protocol use single NZR communication mode. After the pixel power-on reset, the DIN port receive data from controller, the first pixel collect initial 24bit data then sent to the internal data latch, the other data which reshaping by the internal signal reshaping amplification circuit sent to the next cascade pixel through the DO port. After transmission for each pixel,the signal to reduce 24bit. pixel adopt auto reshaping transmit technology, making the pixel cascade number is not limited the signal transmission, only depend on the speed of signal transmission. LED with low driving voltage, environmental protection and energy saving, high brightness, scattering angle is large, good consistency, low power, long life and other advantages. The control chip integrated in LED above becoming more simple circuit, small volume, convenient installation. Absolute Maximum Ratings Power supply voltage: VDD +3.5V..+5.3V Input voltage: VI -0.5V..VDD+0.5V based on WS2812 from https://github.com/adafruit/Adafruit-Eagle-Library
MOSFET = transistor-power:IRF540: HEXFET Power MOSFET
MOTOREN1/2 MOTOREN3/4 = BörningComponents:MOTORTREIBER
Q1 Q2 = BeagleBone_Blue_R3:MOSFET-NCHANNEL: Common NMOSFET Parts MFG P/N Store ID Prod ID FDD8780 TRANS-09984 SI7820DN TRANS-11055 FDS6630A IC-08089 2N7002PW TRANS-11151 FQP30N06L COM-10213 TRANS-10060 BSS123LT1G TRANS-08345 BSS138 TRANS-00830 BS170 2N7000; PROD_ID: TRANS-00830
R1-R29 = resistor:R-EU_: RESISTOR, European symbol
SCHUSSSICHERUNG SICHERUNG5V SICHERUNGMOTOR = BörningComponents:SICHERUNGSHALTER
SENSORIK = BörningComponents:TEENSY3.6_FULL
SHIFTER1 SHIFTER2 = BörningComponents:74HC1G125GW,125: NXP 74HC1G125GW,125 Buffer & Line Driver, 3-State, 2 6 V, 5-Pin TSSOP Source: Datasheet <https://assets.nexperia.com/documents/data-sheet/74HC_HCT1G125.pdf>; DESCRIPTION: NXP 74HC1G125GW,125 Buffer & Line Driver, 3-State, 2 6 V, 5-Pin TSSOP; HEIGHT: 1.1mm; MANUFACTURER_NAME: Nexperia; MANUFACTURER_PART_NUMBER: 74HC1G125GW,125; MOUSER_PART_NUMBER: 771-74HC1G125GW-G; MOUSER_PRICE-STOCK: https://www.mouser.com/Search/Refine.aspx?Keyword=771-74HC1G125GW-G; RS_PART_NUMBER: 1038091; RS_PRICE-STOCK: http://uk.rs-online.com/web/p/products/1038091
SPW = BörningComponents:POLOLU5V9A
STECKERTINKERBOARD = SparkFun-Connectors:CONN_04: Multi connection point. Often used as Generic Header-pin footprint for 0.1 inch spaced/style header connections On any of the 0.1 inch spaced packages, you can populate with these: Break Away Headers - Straight <https://www.sparkfun.com/products/116> (PRT-00116) Break Away Male Headers - Right Angle <https://www.sparkfun.com/products/553> (PRT-00553) Female Headers <https://www.sparkfun.com/products/115> (PRT-00115) Break Away Headers - Machine Pin <https://www.sparkfun.com/products/117> (PRT-00117) Break Away Female Headers - Swiss Machine Pin <https://www.sparkfun.com/products/743> (PRT-00743) For SCREWTERMINALS and SPRING TERMINALS visit here: Screw Terimnals on SparkFun.com <https://www.sparkfun.com/search/results?term=Screw+Terminals> (5mm/3.5mm/2.54mm spacing) This device is also useful as a general connection point to wire up your design to another part of your project. Our various solder wires solder well into these plated through hole pads. Hook-Up Wire - Assortment (Stranded, 22 AWG) <https://www.sparkfun.com/products/11375> (PRT-11375) Hook-Up Wire - Assortment (Solid Core, 22 AWG) <https://www.sparkfun.com/products/11367> (PRT-11367) View the entire wire category on our website here <https://www.sparkfun.com/categories/141> Special notes: Molex polarized connector foot print use with SKU : PRT-08231 with associated crimp pins and housings. 1MM SMD Version SKU: PRT-10208; PROD_ID: CONN-09696; SPICEPREFIX: E
SWITCH1-SWITCH4 = BörningComponents:KIPPY

## Net classes
1 int0.1A: width 0.1 mm, drill 0.1 mm, clearance 0.1 mm to class 0, clearance 0.1 mm
2 int0.4A: width 0.1 mm, drill 0.1 mm, clearance 0.1 mm to class 0, clearance 0.1 mm to class 1, clearance 0.1 mm
3 int1A: width 0.25 mm, drill 0.25 mm, clearance 0.1 mm to class 0, clearance 0.1 mm to class 1, clearance 0.1 mm to class 2, clearance 0.1 mm
4 ext1A: width 0.1 mm, drill 0.1 mm, clearance 0.1 mm to class 0, clearance 0.1 mm to class 1, clearance 0.1 mm to class 2, clearance 0.1 mm to class 3, clearance 0.1 mm
5 ext2A: width 0.25 mm, drill 0.25 mm, clearance 0.1 mm to class 0, clearance 0.1 mm to class 1, clearance 0.1 mm to class 2, clearance 0.1 mm to class 3, clearance 0.1 mm to class 4, clearance 0.1 mm
6 ext3A: width 0.4 mm, drill 0.4 mm, clearance 0.2 mm to class 0, clearance 0.2 mm to class 1, clearance 0.2 mm to class 2, clearance 0.2 mm to class 3, clearance 0.2 mm to class 4, clearance 0.2 mm to class 5, clearance 0.2 mm
7 ext4A: width 0.6 mm, drill 0.6 mm, clearance 0.3 mm to class 0, clearance 0.3 mm to class 1, clearance 0.3 mm to class 2, clearance 0.3 mm to class 3, clearance 0.3 mm to class 4, clearance 0.3 mm to class 5, clearance 0.3 mm to class 6, clearance 0.3 mm
8 ext5A: width 0.8 mm, drill 0.8 mm, clearance 0.4 mm to class 0, clearance 0.4 mm to class 1, clearance 0.4 mm to class 2, clearance 0.4 mm to class 3, clearance 0.4 mm to class 4, clearance 0.4 mm to class 5, clearance 0.4 mm to class 6, clearance 0.4 mm to class 7, clearance 0.4 mm
9 ext6A: width 1.1 mm, drill 1.1 mm, clearance 0.6 mm to class 0, clearance 0.6 mm to class 1, clearance 0.6 mm to class 2, clearance 0.6 mm to class 3, clearance 0.6 mm to class 4, clearance 0.6 mm to class 5, clearance 0.6 mm to class 6, clearance 0.6 mm to class 7, clearance 0.6 mm to class 8, clearance 0.6 mm
10 ext7A: width 1.3 mm, drill 1.3 mm, clearance 0.7 mm to class 0, clearance 0.7 mm to class 1, clearance 0.7 mm to class 2, clearance 0.7 mm to class 3, clearance 0.7 mm to class 4, clearance 0.7 mm to class 5, clearance 0.7 mm to class 6, clearance 0.7 mm to class 7, clearance 0.7 mm to class 8, clearance 0.7 mm to class 9, clearance 0.7 mm
11 ext8A: width 1.6 mm, drill 1.6 mm, clearance 0.7 mm to class 0, clearance 0.7 mm to class 1, clearance 0.7 mm to class 2, clearance 0.7 mm to class 3, clearance 0.7 mm to class 4, clearance 0.7 mm to class 5, clearance 0.7 mm to class 6, clearance 0.7 mm to class 7, clearance 0.7 mm to class 8, clearance 0.7 mm to class 9, clearance 0.7 mm to class 10, clearance 0.7 mm
12 ext9A: width 1.8 mm, drill 1.8 mm, clearance 0.7 mm to class 0, clearance 0.7 mm to class 1, clearance 0.7 mm to class 2, clearance 0.7 mm to class 3, clearance 0.7 mm to class 4, clearance 0.7 mm to class 5, clearance 0.7 mm to class 6, clearance 0.7 mm to class 7, clearance 0.7 mm to class 8, clearance 0.7 mm to class 9, clearance 0.7 mm to class 10, clearance 0.7 mm to class 11, clearance 0.7 mm
13 ext10A: width 2.1 mm, drill 2.1 mm, clearance 0.7 mm to class 0, clearance 0.7 mm to class 1, clearance 0.7 mm to class 2, clearance 0.7 mm to class 3, clearance 0.7 mm to class 4, clearance 0.7 mm to class 5, clearance 0.7 mm to class 6, clearance 0.7 mm to class 7, clearance 0.7 mm to class 8, clearance 0.7 mm to class 9, clearance 0.7 mm to class 10, clearance 0.7 mm to class 11, clearance 0.7 mm to class 12, clearance 0.7 mm
14 ext25A: width 7.3 mm, drill 7.3 mm, clearance 1 mm to class 0, clearance 1 mm to class 1, clearance 1 mm to class 2, clearance 1 mm to class 3, clearance 1 mm to class 4, clearance 1 mm to class 5, clearance 1 mm to class 6, clearance 1 mm to class 7, clearance 1 mm to class 8, clearance 1 mm to class 9, clearance 1 mm to class 10, clearance 1 mm to class 11, clearance 1 mm to class 12, clearance 1 mm to class 13, clearance 1 mm